# Altium schematic sheet DebuggerConnectors.SchDoc
size A4
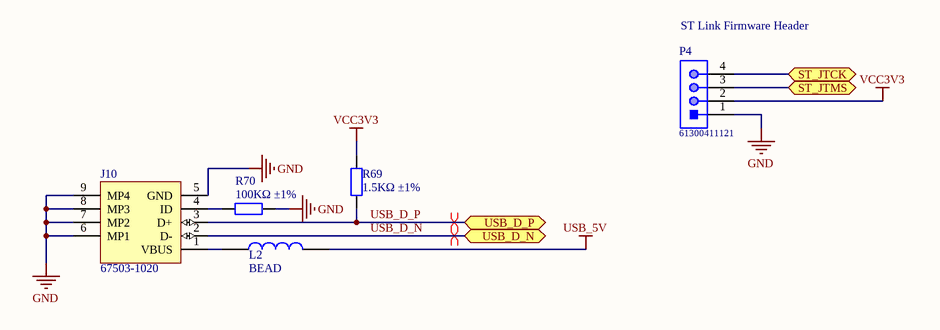
[diagram p0: DebuggerConnectors.SchDoc]

## Parts
J10  67503-1020  [MOLX-67503-1020_V]
L2  BEAD  [0603_L]
P4  61300411121  [61300411121]
R69  1.5KΩ ±1%  [0402_R]
R70  100KΩ ±1%  [0402_R]

## Ports
ST_JTCK (bidir), ST_JTMS (bidir), USB_D_N (bidir), USB_D_P (bidir)

## Nets
GND: J10.5(GND) J10.6(MP1) J10.7(MP2) J10.8(MP3) J10.9(MP4) P4.1 R70.2
USB_5V: L2.2
VCC3V3: P4.2 R69.2
ST_JTCK: P4.4 ; port ST_JTCK
ST_JTMS: P4.3 ; port ST_JTMS
USB_D_N: J10.2(D-) ; port USB_D_N
USB_D_P: J10.3(D+) R69.1 ; port USB_D_P
NetJ10_1: J10.1(VBUS) L2.1
NetJ10_4: J10.4(ID) R70.1

## Layout directives
differential pair: USB_D_N, USB_D_P

## Notes on the sheet
- (near P4) ST Link Firmware Header

## Library data of the parts
J10 = CMP-0411-00002-1: USB, MINI, SMD, RA KME04-USBMU03A01; Manufacturer: Molex; ComponentLink1URL: http://www.molex.com/; PartNumber: 67503-1020; Mounting Technology: Surface Mount; ComponentLink1Description: Manufacturer URL; Terminal Pitch: 0.8 mm; DatasheetVersion: Rev F, 06/2009; ComponentLink2Description: Datasheet; PackageDescription: Mini USB Connector, SMT, Righer Angle; ComponentLink2URL: http://www.molex.com/pdm_docs/sd/675031020_sd.pdf; PackageReference: 67503-1020
L2 = 0603 100R@100Mhz 1A: Ferrite Bead; Notepad: *; Package: 0603; Supplier: LC; SuppliersPartNumber: C64181
P4 = CMP-1502-01064-1: THT Vertical Pin Header WR-PHD, Pitch 2.54 mm, Single Row, 4 pins; Manufacturer: Wurth Elektronik; Withstanding Voltage: 500VAC; Rated Current: 3A; Working Voltage: 250VAC; Pin Number: 4; Gender: Male; Contact Resistance: 20mOhm; Pitch: 2.54mm; Manufacturer URL: http://www.we-online.de; Operating Temperature: -40to105degC; Packaging: Bag; Mounting Technology: THT; Package Reference: 61300411121; Datasheet URL: https://katalog.we-online.de/em/datasheet/6130xx11121.pdf; Publisher: WurthElektronik; Part Number: 61300411121; Row Number: Single; Orientation: Vertical
R69 = 0402 1.5K (1501) 1%: Chip resistor; Manufacturer: Uniroyal Elec; PartNumber: 0402WGF1501TCE; Power: 1/16W; ComponentLink1Description: Supplier link; ComponentLink1URL: http://www.szlcsc.com/product/details_26610.html; Package: 0402; Supplier: LC; SuppliersPartNumber: C25867; Resistance: 1.5KΩ; Tolerance: 1%
R70 = 0402 100K (1003) 1%: Chip resistor; Manufacturer: Uniroyal Elec; PartNumber: 0402WGF1003TCE; Power: 1/16W; ComponentLink1Description: Supplier link; ComponentLink1URL: http://www.szlcsc.com/product/details_26484.html; Package: 0402; Supplier: LC; SuppliersPartNumber: C25741; Resistance: 100KΩ; Tolerance: 1%